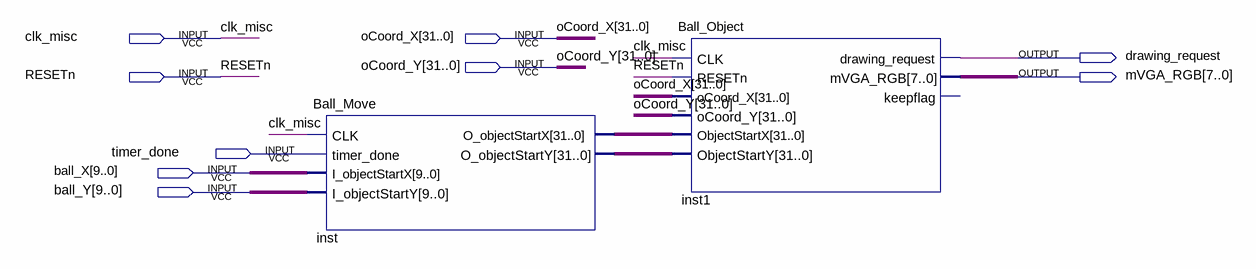
[diagram p0: schematic sheet]
// Quartus schematic Ball_Draw.bdf as structural Verilog: 2 symbols, 9 pins
module Ball_Draw (
  input  clk_misc,
  input  [31:0] oCoord_X,
  input  [31:0] oCoord_Y,
  input  RESETn,
  input  timer_done,
  input  [9:0] ball_X,
  input  [9:0] ball_Y,
  output drawing_request,
  output [7:0] mVGA_RGB
);

  wire [31:0] inst_o_objectstartx, inst_o_objectstarty;

  Ball_Move inst (
    .CLK(clk_misc), .timer_done(timer_done), .I_objectStartX(ball_X), .I_objectStartY(ball_Y),
    .O_objectStartX(inst_o_objectstartx), .O_objectStartY(inst_o_objectstarty));
  Ball_Object inst1 (
    .CLK(clk_misc), .RESETn(RESETn), .oCoord_X(oCoord_X), .oCoord_Y(oCoord_Y),
    .ObjectStartX(inst_o_objectstartx), .ObjectStartY(inst_o_objectstarty),
    .drawing_request(drawing_request), .mVGA_RGB(mVGA_RGB));  // open: keepflag
endmodule
